# Altium schematic sheet [07] - Sensors and RTC.SchDoc: =ProjectName
size A4; CheckedBy: Ven; Author: Ven; CompanyName: HUST; Revision: V.1.0
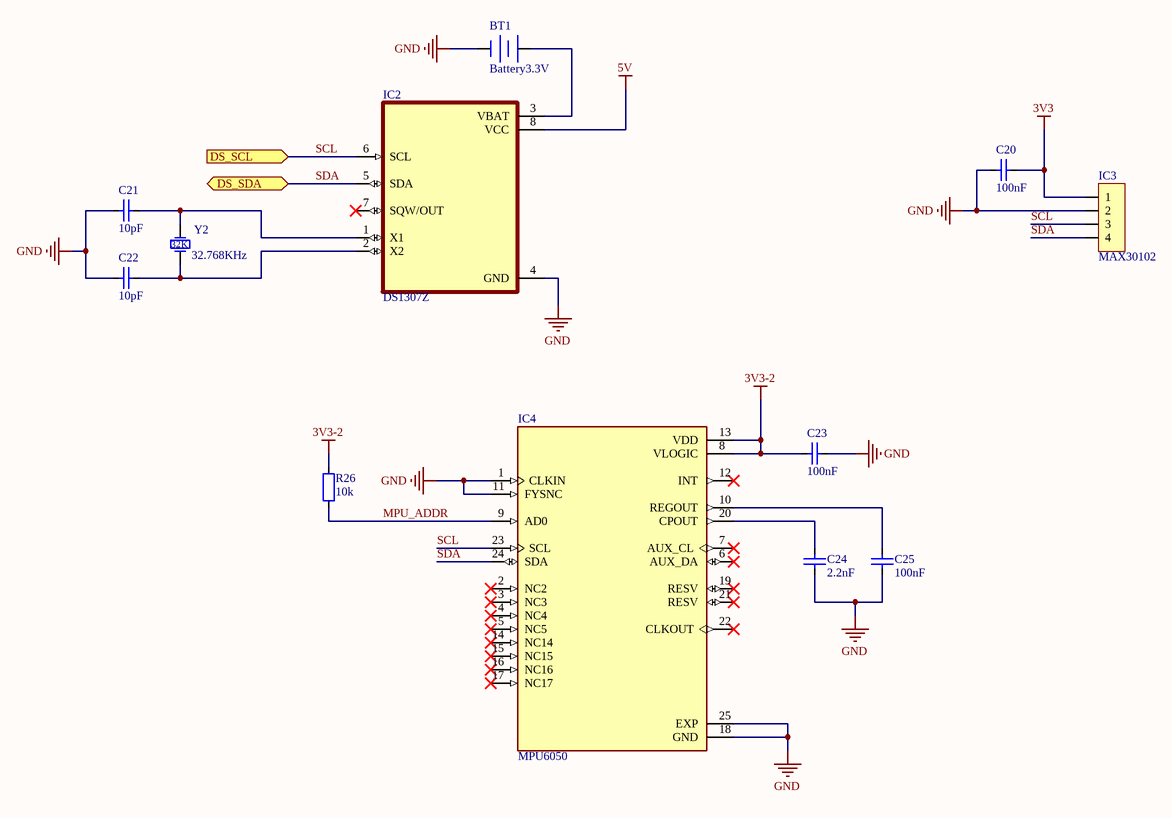
[diagram p0: [07] - Sensors and RTC.SchDoc]

## Parts
BT1  Battery3.3V  [CR1220 SMD]
C20  100nF  [CAP_0603]
C21  10pF  [CAP_0603]
C22  10pF  [CAP_0603]
C23  100nF  [CAP_0603]
C24  2.2nF  [CAP_0603]
C25  100nF  [CAP_0603]
IC2  DS1307Z  [SOIC-8]
IC3  MAX30102  [JP4-C1T]
IC4  MPU6050  [QFN24]
R26  10k  [RES-SMD-0603]
Y2  32.768KHz  [XTAL32K]

## Ports
DS_SCL (in), DS_SDA (bidir)

## Nets
3V3: C20.1 IC3.1
3V3-2: C23.2 IC4.8(VLOGIC) IC4.13(VDD) R26.2
5V: IC2.8(VCC)
GND: BT1.2(-) C20.2 C21.1 C22.1 C23.1 C24.1 C25.1 IC2.4(GND) IC3.2 IC4.1(CLKIN) IC4.11(FYSNC) IC4.18(GND) IC4.25(EXP) Y2.0
MPU_ADDR: IC4.9(AD0) R26.1
SCL: IC2.6(SCL) IC3.3 IC4.23(SCL) ; port DS_SCL
SDA: IC2.5(SDA) IC3.4 IC4.24(SDA) ; port DS_SDA
NetBT1_1: BT1.1(+) IC2.3(VBAT)
NetC21_2: C21.2 IC2.1(X1) Y2.1(OSC1)
NetC22_2: C22.2 IC2.2(X2) Y2.2(OSC2)
NetC24_2: C24.2 IC4.20(CPOUT)
NetC25_2: C25.2 IC4.10(REGOUT)

Not connected (* = marked no-connect by the designer): IC2 7(SQW/OUT)*; IC4 2(NC2)* 3(NC3)* 4(NC4)* 5(NC5)* 6(AUX_DA)* 7(AUX_CL)* 12(INT)* 14(NC14)* 15(NC15)* 16(NC16)* 17(NC17)* 19(RESV)* 21(RESV)* 22(CLKOUT)*

## Notes on the sheet
- Project:
- Page Contents:
- Size:
- Date:
- A4
- Checked by:
- Time:
- Revision:
- Sheet
- of
- File:
- (in symbol XTAL/32KHz) 32K

## Library data of the parts
BT1 = Battery3.3V: Multicell Battery; Published: 24-Mar-1999; LatestRevisionDate: 17-Jul-2002; LatestRevisionNote: Re-released for DXP Platform.; PackageReference: BAT-2; Publisher: Altium Limited
C20-C25 = CapSMD: Capacitor; Value: 33p; Published: 8-Jun-2000; LatestRevisionDate: 17-Jul-2002; LatestRevisionNote: Re-released for DXP Platform.; PackageReference: RAD-0.3; Publisher: Altium Limited
IC2 = DS1307Z: 0x68
IC3 = JP4: 0x57; Manufacturer: W¨¹rth Elektronik eiSos GmbH; partNo: 613004143121; ComponentLink1 Description: Manufacturer; ComponentLink2 Description: Datasheet; NoPins: 04; Created Date: 29 March 2013; ComponentLink1URL: http://www.we-online.com; ComponentLink2URL: http://katalog.we-online.de/em/datasheet/6130xx143121.pdf; Created by: Karrer Zheng
IC4 = MPU6050_Chip: 3-axis gyroscope, 3-axis accelerometer / 0x69
R26 = Resistor - SMD: Resistor; Manufacturer: Generic Components; Class: Passive; Published: 08/06/2000; Publisher: Altium Hobart Technology Centre
Y2 = XTAL/32KHz: Crystal Oscillator; Published: 8-Jun-2000; LatestRevisionDate: 17-Jul-2002; LatestRevisionNote: Re-released for DXP Platform.; PackageReference: R38; Publisher: Altium Limited